# Altium schematic sheet Э52.SchDoc
size A3
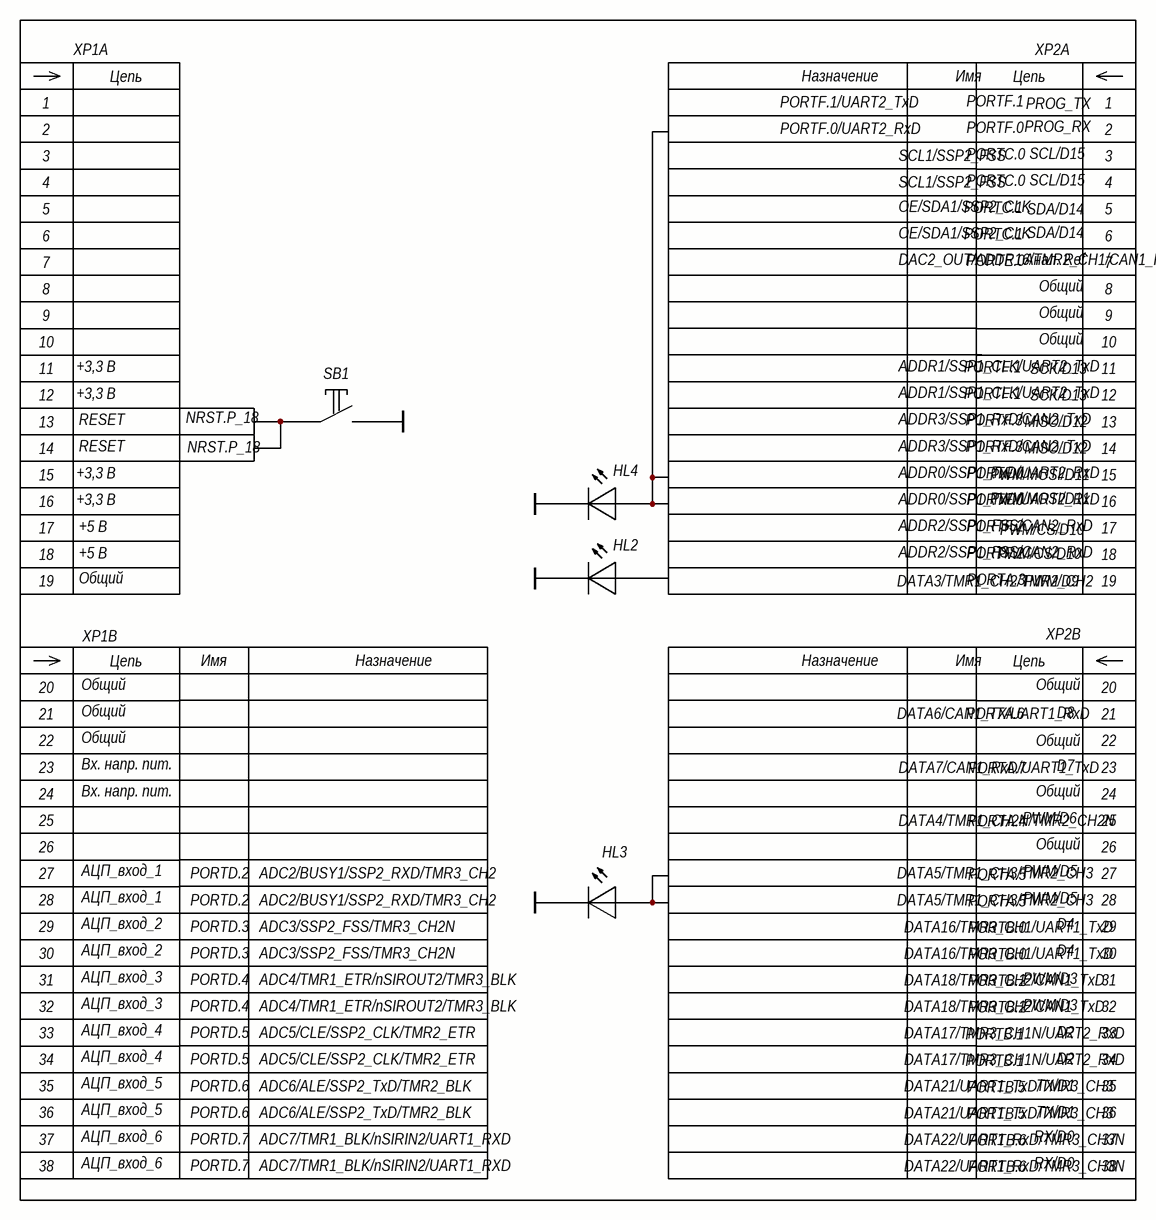
[diagram p0: Э52.SchDoc]

## Parts
HL2  Светодиод  [DIODE: LED3MM_G]  (value not drawn)
HL3  Светодиод  [DIODE: LED3MM_G]  (value not drawn)
HL4  Светодиод  [DIODE: LED3MM_G]  (value not drawn)
SB?  Переключатель  [BUT: 6x6 SMD]  (value not drawn)  (part A of 2)
XP1  Вилка  [PLDH-38]  (value not drawn)  (parts A,B of 2)
XP2  Вилка  [PLDH-38]  (value not drawn)  (parts A,B of 2)

## Nets
GND: HL2.K HL3.K HL4.K SB?.2

Not connected (* = marked no-connect by the designer): HL2 A; HL3 A; HL4 A; SB? 1

## Notes on the sheet
- PORTF.1/UART2_TxD
- PORTF.0/UART2_RxD
- Назначение
- Имя
- PORTF.0
- PORTF.1
- PROG_RX
- PROG_TX
- SCL1/SSP2_FSS
- PORTC.0
- SCL/D15
- OE/SDA1/SSP2_CLK
- DAC2_OUT/ADDR16/TMR2_CH1/CAN1_RхD
- PORTC.1
- (near XP2) PORTE.0
- Анал. Ref
- SDA/D14
- Общий
- +3,3 В
- (near SB?) SB1
- ADDR1/SSP1_CLK/UART2_TxD
- SCK/D13
- RESET
- NRST.P_18
- ADDR3/SSP1_RxD/CAN2_TxD
- PORTF.3
- MISO/D12
- +5 В
- ADDR0/SSP1_TxD/UART2_RxD
- ADDR2/SSP1_FSS/CAN2_RxD
- PORTF.2
- PWM/MOSI/D11
- PWM/CS/D10
- DATA3/TMR1_CH2/TMR2_CH2
- PORTA.3
- PWM/D9
- DATA6/CAN1_TX/UART1_RxD
- PORTA.6
- D8
- Вх. напр. пит.
- DATA7/CAN1_RxD/UART1_TxD
- PORTA.7
- D7
- (near XP1) АЦП_вход_1
- (near XP1) PORTD.2
- ADC2/BUSY1/SSP2_RXD/TMR3_CH2
- DATA5/TMR1_CH3/TMR2_CH3
- DATA4/TMR1_CH2N/TMR2_CH2N
- PORTA.4
- (near XP2) PORTA.5
- PWM/D6
- (near XP2) PWM/D5
- (near XP1) АЦП_вход_2
- (near XP1) PORTD.3
- ADC3/SSP2_FSS/TMR3_CH2N
- DATA16/TMR3_CH1/UART1_TxD
- (near XP2) PORTB.0
- D4
- АЦП_вход_2
- АЦП_вход_3
- PORTD.4
- PORTD.3
- ADC4/TMR1_ETR/nSIROUT2/TMR3_BLK
- DATA18/TMR3_CH2/CAN1_TxD
- PORTB.0
- PORTB.2
- PWM/D3
- АЦП_вход_4
- PORTD.5
- ADC5/CLE/SSP2_CLK/TMR2_ETR
- DATA17/TMR3_CH1N/UART2_RxD
- PORTB.1
- D2
- АЦП_вход_5
- АЦП_вход_6
- PORTD.6
- PORTD.7
- ADC6/ALE/SSP2_TxD/TMR2_BLK
- ADC7/TMR1_BLK/nSIRIN2/UART1_RXD
- DATA21/UART1_TxD/TMR3_CH3
- DATA22/UART1_RxD/TMR3_CH3N
- PORTB.5
- PORTB.6
- RX/D0
- TX/D1
- (in symbol Вилка 38 контактов, part A) Цепь; 1; 2; 3; 4; 5; 6; 7; 8; 9; 10; 11; 12; 13; 14; 15; 16; 17; 18; 19
- (in symbol Вилка 38 контактов, part B) Цепь; 20; 21; 22; 23; 24; 25; 26; 27; 28; 29; 30; 31; 32; 33; 34; 35; 36; 37; 38

## Library data of the parts
HL2-HL4 = Светодиоды: Betlux Electronics; TU/GOST: Фирма "Betlux Electronics"; Value: 2.1 V; Model: BL-L2506URC; Product Code: 63 1000; Published: 24-Mar-1999; LatestRevisionDate: 17-Jul-2002; LatestRevisionNote: Re-released for DXP Platform.; PackageReference: PIN2; Publisher: Altium Limited; Distributer: АО "Чип и Дип"; Category: Светодиод; Component Name: BL-L2506URC
SB? = BT-02x-01p_S: фирма KLS electronic co ltd; Product Code: 34 6422; Component Name: KLS7-TS6604-7.0-180-B(Т); Published: 17.04.2014; Publisher: Andrew Danich; Type: Переключатель; TU/GOST: фирма KLS electronic co ltd; Distributer: ЗАО "Чип и Дип"
XP1 XP2 = Вилка 38 контактов: РЮМК.430420.019 ТУ; TU/GOST: РЮМК.430420.041 ТУ; Product Code: 66 7250; Component Name: СНП377-38ВП21-2-14-6,0; Distributer: АО "КАРАЧЕВСКИЙ ЗАВОД "ЭЛЕКТРОДЕТАЛЬ"; Category: Вилка